# Altium schematic sheet Nucleo.SchDoc
size Letter; SheetNumber: 3; SheetTotal: 11
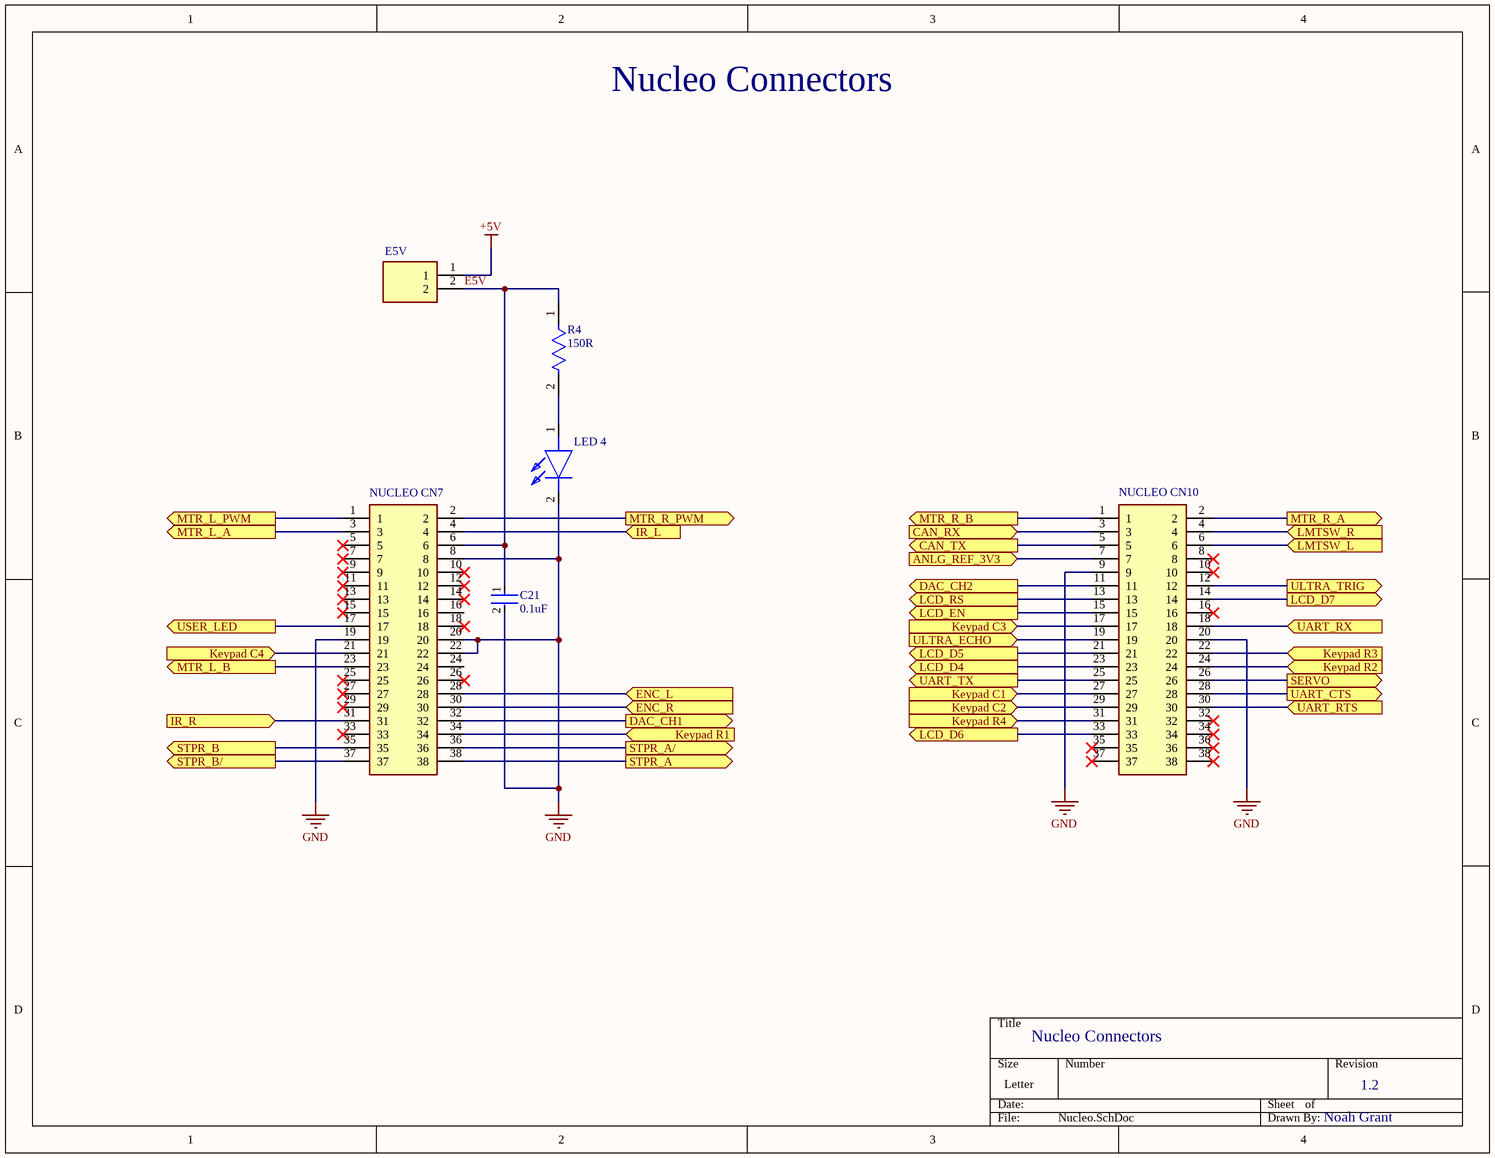
[diagram p0: Nucleo.SchDoc]

## Parts
C21  0.1uF  [FP-CC0603-DA-MFG]
E5V  0022284023  [HDRV2W87P0X254_1X2_508X249X863P]  (value not drawn)
LED_4  APL3015EC-F01  [APL3015ECF01]  (value not drawn)
NUCLEO_CN7  SSW-119-01-G-D-LL  [SSW-119-XX-YYY-D-LL]  (value not drawn)
NUCLEO_CN10  SSW-119-01-G-D-LL  [SSW-119-XX-YYY-D-LL]  (value not drawn)
R4  150R  [FP-MCT0603-IPC_C]

## Ports
ANLG_REF_3V3 (in, see Top_Sheet[3B], CAN_DAC[3D], CAN_DAC[4B]), CAN_RX (in, see Top_Sheet[3B], CAN_DAC[1B]), CAN_TX (out, see Top_Sheet[3B], CAN_DAC[1B]), DAC_CH1 (out, see Top_Sheet[3B], CAN_DAC[3B]), DAC_CH2 (out, see Top_Sheet[3B], CAN_DAC[3B]), ENC_L (in, see Top_Sheet[2B], DCMTR_ENC[2B], Debug[1B]), ENC_R (in, see Top_Sheet[2B], DCMTR_ENC[1B], Debug[1B]), IR_L (in, see Top_Sheet[3A], IR[2C]), IR_R (in, see Top_Sheet[3A], IR[4C]), Keypad C1 (in, see Top_Sheet[2C], Keypad[3B]), Keypad C2 (in, see Top_Sheet[2C], Keypad[3B]), Keypad C3 (in, see Top_Sheet[2C], Keypad[3B]), Keypad C4 (in, see Top_Sheet[2C], Keypad[3B]), Keypad R1 (in, see Top_Sheet[2C], Keypad[3C]), Keypad R2 (in, see Top_Sheet[2C], Keypad[3C]), Keypad R3 (in, see Top_Sheet[2C], Keypad[3B]), Keypad R4 (in, see Top_Sheet[2C], Keypad[3B]), LCD_D4 (out, see Top_Sheet[3C], LCD_ULTRA[1C]), LCD_D5 (out, see Top_Sheet[3C], LCD_ULTRA[1C]), LCD_D6 (out, see Top_Sheet[3C], LCD_ULTRA[1C]), LCD_D7 (out, see Top_Sheet[3C], LCD_ULTRA[1C]), LCD_EN (out, see Top_Sheet[3C], LCD_ULTRA[1B]), LCD_RS (out, see Top_Sheet[3C], LCD_ULTRA[1B]), LMTSW_L (in, see Top_Sheet[2B], Debug[3B], STPR_LMTSW_SRV[2C]), LMTSW_R (in, see Top_Sheet[2B], Debug[3B], STPR_LMTSW_SRV[2D]), MTR_L_A (out, see Top_Sheet[2A], DCMTR_ENC[3C], Debug[1B]), MTR_L_B (out, see Top_Sheet[2B], DCMTR_ENC[3C], Debug[1B]), MTR_L_PWM (out, see Top_Sheet[2A], DCMTR_ENC[3C], Debug[1B]), MTR_R_A (out, see Top_Sheet[2B], DCMTR_ENC[3C], Debug[1B]), MTR_R_B (out, see Top_Sheet[2B], DCMTR_ENC[3C], Debug[1B]), MTR_R_PWM (out, see Top_Sheet[2A], DCMTR_ENC[3C], Debug[1B]), SERVO (out, see Top_Sheet[2B], Debug[3B], STPR_LMTSW_SRV[3C]), STPR_A (out, see Top_Sheet[2B], Debug[3B], STPR_LMTSW_SRV[1B]), STPR_A/ (out, see Top_Sheet[2B], Debug[3B], STPR_LMTSW_SRV[1B]), STPR_B (out, see Top_Sheet[2B], Debug[3B], STPR_LMTSW_SRV[1B]), STPR_B/ (out, see Top_Sheet[2B], Debug[3B], STPR_LMTSW_SRV[1B]), UART_CTS (out, see Top_Sheet[3B], RS232[1B]), UART_RTS (in, see Top_Sheet[3B], RS232[3B]), UART_RX (in, see Top_Sheet[3B], RS232[3B]), UART_TX (out, see Top_Sheet[3B], RS232[1B]), ULTRA_ECHO (in, see Top_Sheet[3C], LCD_ULTRA[4B]), ULTRA_TRIG (out, see Top_Sheet[3C], LCD_ULTRA[3B]), USER_LED (out, see Top_Sheet[3C], Debug[1C])

## Nets
+5V: E5V.1
GND: C21.2 LED_4.2(K) NUCLEO_CN7.8 NUCLEO_CN7.19 NUCLEO_CN7.20 NUCLEO_CN7.22 NUCLEO_CN10.9 NUCLEO_CN10.20
ANLG_REF_3V3: NUCLEO_CN10.7 ; port ANLG_REF_3V3
CAN_RX: NUCLEO_CN10.3 ; port CAN_RX
CAN_TX: NUCLEO_CN10.5 ; port CAN_TX
DAC_CH1: NUCLEO_CN7.32 ; port DAC_CH1
DAC_CH2: NUCLEO_CN10.11 ; port DAC_CH2
E5V: C21.1 E5V.2 NUCLEO_CN7.6 R4.1
ENC_L: NUCLEO_CN7.28 ; port ENC_L
ENC_R: NUCLEO_CN7.30 ; port ENC_R
IR_L: NUCLEO_CN7.4 ; port IR_L
IR_R: NUCLEO_CN7.31 ; port IR_R
Keypad C1: NUCLEO_CN10.27 ; port Keypad C1
Keypad C2: NUCLEO_CN10.29 ; port Keypad C2
Keypad C3: NUCLEO_CN10.17 ; port Keypad C3
Keypad C4: NUCLEO_CN7.21 ; port Keypad C4
Keypad R1: NUCLEO_CN7.34 ; port Keypad R1
Keypad R2: NUCLEO_CN10.24 ; port Keypad R2
Keypad R3: NUCLEO_CN10.22 ; port Keypad R3
Keypad R4: NUCLEO_CN10.31 ; port Keypad R4
LCD_D4: NUCLEO_CN10.23 ; port LCD_D4
LCD_D5: NUCLEO_CN10.21 ; port LCD_D5
LCD_D6: NUCLEO_CN10.33 ; port LCD_D6
LCD_D7: NUCLEO_CN10.14 ; port LCD_D7
LCD_EN: NUCLEO_CN10.15 ; port LCD_EN
LCD_RS: NUCLEO_CN10.13 ; port LCD_RS
LMTSW_L: NUCLEO_CN10.6 ; port LMTSW_L
LMTSW_R: NUCLEO_CN10.4 ; port LMTSW_R
MTR_L_A: NUCLEO_CN7.3 ; port MTR_L_A
MTR_L_B: NUCLEO_CN7.23 ; port MTR_L_B
MTR_L_PWM: NUCLEO_CN7.1 ; port MTR_L_PWM
MTR_R_A: NUCLEO_CN10.2 ; port MTR_R_A
MTR_R_B: NUCLEO_CN10.1 ; port MTR_R_B
MTR_R_PWM: NUCLEO_CN7.2 ; port MTR_R_PWM
SERVO: NUCLEO_CN10.26 ; port SERVO
STPR_A: NUCLEO_CN7.38 ; port STPR_A
STPR_A/: NUCLEO_CN7.36 ; port STPR_A/
STPR_B: NUCLEO_CN7.35 ; port STPR_B
STPR_B/: NUCLEO_CN7.37 ; port STPR_B/
UART_CTS: NUCLEO_CN10.28 ; port UART_CTS
UART_RTS: NUCLEO_CN10.30 ; port UART_RTS
UART_RX: NUCLEO_CN10.18 ; port UART_RX
UART_TX: NUCLEO_CN10.25 ; port UART_TX
ULTRA_ECHO: NUCLEO_CN10.19 ; port ULTRA_ECHO
ULTRA_TRIG: NUCLEO_CN10.12 ; port ULTRA_TRIG
USER_LED: NUCLEO_CN7.17 ; port USER_LED
NetLED_4_1: LED_4.1(A) R4.2

Not connected (* = marked no-connect by the designer): NUCLEO_CN7 5* 7* 9* 10* 11* 12* 13* 14* 15* 16 18* 24 25* 26* 27* 29* 33*; NUCLEO_CN10 8* 10* 16* 32* 34* 35* 36* 37* 38*

## Notes on the sheet
- Nucleo Connectors
- 1.2
- Noah Grant

## Library data of the parts
C21 = CMP-03422-000468-1: CAP CER 0.1UF 50V X7R 0603; Manufacturer: YAGEO; Manufacturer Part Number: CC0603KPX7R9BB104; Temperature Coefficient: 15%; Capacitance: 100 nF; Material: Ceramic; Value: 100 nF; Tolerance: 0.1; Device Class L1: Passive Components; Temperature Range High: +125°C; ComponentLink2Description: Datasheet; Temperature Characteristic: X7R; Octopart: https://octopart.com/cc0603kpx7r9bb104-yageo-12885113; Height: 0.9mm; Mouser Description: Multilayer Ceramic Capacitors MLCC - SMD/SMT 100nF 50V X7R 10%; Device Class L3: Ceramic Capacitors; Voltage Rating: 50 V; Device Class L2: Capacitors; ComponentLink2URL: http://www.yageo.com/documents/recent/UPY-GPHC_X7R_6.3V-to-50V_18.pdf; Package: CC0603-DA; Automotive: No; Voltage: 50 V; RoHS: TRUE; Lead Free: Yes; Digikey Description: CAP CER 0.1UF 50V X7R 0603; Footprint Url: http://www.yageo.com/exep/pages/download/literatures/UPY-C_GEN_24.pdf; Temperature Range Low: -55°C; Temperature: -55°C to +125°C; Category: Cap
E5V = 0022284023: Connector; Manufacturer_Name: Molex; Datasheet Link: https://www.molex.com/pdm_docs/sd/022284023_sd.pdf; Height: 8.63mm; Manufacturer_Part_Number: 0022284023; Mouser Part Number: N/A; Mouser Price/Stock: https://www.mouser.co.uk/ProductDetail/Molex/0022284023?qs=PBcRNPEHKsr%2FPE%2F%252B8ije0g%3D%3D; Arrow Part Number: 0022284023; Arrow Price/Stock: https://www.arrow.com/en/products/0022284023/molex
LED_4 = APL3015EC-F01: LED; Manufacturer_Name: Kingbright; Datasheet Link: https://componentsearchengine.com/Datasheets/1/APL3015EC-F01.pdf; Manufacturer_Part_Number: APL3015EC-F01; Mouser Part Number: 604-APL3015EC-F01; Mouser Price/Stock: https://www.mouser.co.uk/ProductDetail/Kingbright/APL3015EC-F01?qs=VdjlWU%2FzoOF91deOgS6C3g%3D%3D
NUCLEO_CN7 NUCLEO_CN10 = SSW-119-01-G-D-LL: Connector; Manufacturer_Name: SAMTEC; Datasheet Link: http://suddendocs.samtec.com/prints/ssw-1xx-xx-xxx-x-xx-xxx-xx-mkt.pdf; Manufacturer_Part_Number: SSW-119-01-G-D-LL
R4 = CMP-02407-011712-1: RES SMD 100 OHM 1% 1/8W 0603; Power Rating: 125mW; Tolerance: 0.5%; Voltage Rating: 75V; Max Power Dissipation: 150mW; Temperature Coefficient: 25ppm/°C; Resistance: 150R; Packaging: Tape and Reel; Termination: SMD/SMT; Construction: Rectangular; Max Operating Temperature: 175°C; Length: 0.061inch; Case/Package: 0603; Depth: 0.85mm; Military Standard: Not; Case Code (Metric): 1608; Package Quantity: 1; Width: 0.8mm; Features: Automotive AEC-Q200; Height: 0.022inch; REACH SVHC: No SVHC; Min Operating Temperature: -55°C; Resistor Type: Thin Film; RoHS Compliant: Yes; Resistance Tolerance: 0.5%; Series: MCT 0603 - Professional; Voltage Rating (DC): 75V; Number of Terminations: 2; Case Code (Imperial): 0603; Number of Pins: 2